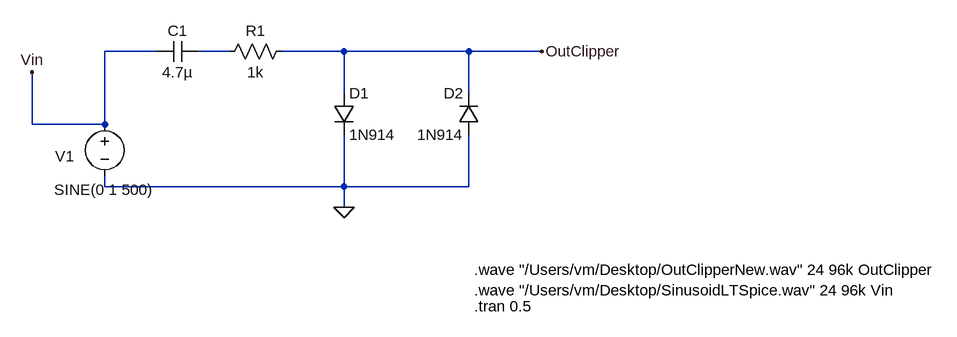
[diagram p0: schematic doublediodes.asc]
doublediodes.asc, the LTspice schematic file:
Version 4
SHEET 1 1232 700
WIRE 16 240 -64 240
WIRE 128 240 80 240
WIRE 304 240 208 240
WIRE 496 240 304 240
WIRE 608 240 496 240
WIRE 304 304 304 240
WIRE 496 304 496 240
WIRE -176 352 -176 272
WIRE -64 352 -64 240
WIRE -64 352 -176 352
WIRE -64 448 -64 432
WIRE 304 448 304 368
WIRE 304 448 -64 448
WIRE 496 448 496 368
WIRE 496 448 304 448
WIRE 304 480 304 448
FLAG 304 480 0
FLAG 608 240 OutClipper
FLAG -176 272 Vin
SYMBOL cap 80 224 R90
WINDOW 0 0 32 VBottom 2
WINDOW 3 32 32 VTop 2
SYMATTR InstName C1
SYMATTR Value 4.7µ
SYMBOL res 224 224 R90
WINDOW 0 0 56 VBottom 2
WINDOW 3 32 56 VTop 2
SYMATTR InstName R1
SYMATTR Value 1k
SYMBOL diode 288 304 R0
SYMATTR InstName D1
SYMATTR Value 1N914
SYMBOL diode 512 368 R180
WINDOW 0 24 64 Left 2
WINDOW 3 24 0 Left 2
SYMATTR InstName D2
SYMATTR Value 1N914
SYMBOL voltage -64 336 R0
WINDOW 3 -78 117 Left 2
WINDOW 0 -76 65 Left 2
SYMATTR Value SINE(0 1 500)
SYMATTR InstName V1
SYMATTR SpiceLine Rser=0
TEXT 504 576 Left 2 !.wave "/Users/vm/Desktop/OutClipperNew.wav" 24 96k OutClipper\n.wave "/Users/vm/Desktop/SinusoidLTSpice.wav" 24 96k Vin
TEXT 504 632 Left 2 !.tran 0.5

The netlist it stands for:
* doublediodes.asc
C1 N001 Vin 4.7µ
R1 OutClipper N001 1k
D1 OutClipper 0 1N914
D2 0 OutClipper 1N914
V1 Vin 0 SINE(0 1 500) Rser=0
.model D D
.lib standard.dio
.wave "/Users/vm/Desktop/OutClipperNew.wav" 24 96k OutClipper
.wave "/Users/vm/Desktop/SinusoidLTSpice.wav" 24 96k Vin
.tran 0.5
.backanno
.end